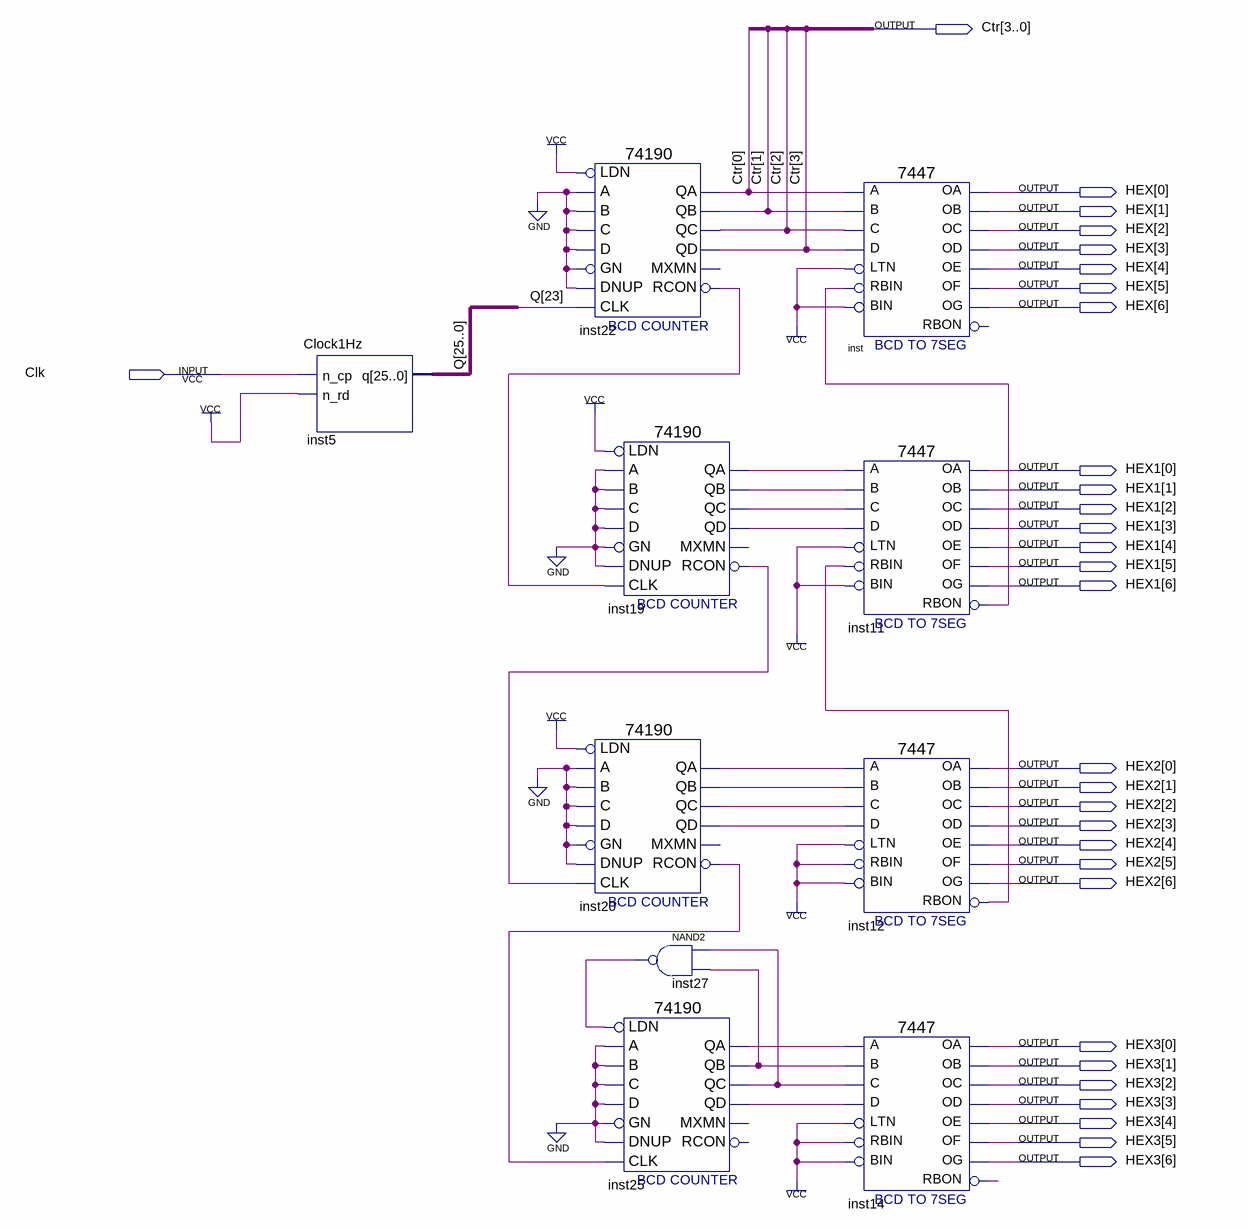
[diagram p0: schematic sheet]
// Quartus schematic 4digitsSeg.bdf as structural Verilog: 10 symbols, 30 pins
module \4digitsSeg  (
  input  Clk,
  output [3:0] Ctr,
  output [6:0] HEX,
  output [6:0] HEX1,
  output [6:0] HEX2,
  output [6:0] HEX3
);

  wire inst11_rbon, inst12_rbon, inst14_rbon, inst19_qa, inst19_qb, inst19_qc, inst19_qd, inst19_rcon,
       inst20_qa, inst20_qb, inst20_qc, inst20_qd, inst20_rcon, inst22_rcon, inst25_qa, inst25_qb, inst25_qc,
       inst25_qd, inst27_out;
  wire [25:0] Q;

  Clock1Hz inst5 (.n_cp(Clk), .n_rd(1'b1), .q(Q));
  \74190  inst22 (
    .LDN(1'b1), .A(1'b0), .C(1'b0), .B(1'b0), .D(1'b0), .GN(1'b0), .CLK(Q[23]), .DNUP(1'b0), .QA(Ctr[0]),
    .QB(Ctr[1]), .QD(Ctr[3]), .QC(Ctr[2]), .RCON(inst22_rcon));  // open: MXMN
  \74190  inst20 (
    .LDN(1'b1), .A(1'b0), .C(1'b0), .B(1'b0), .D(1'b0), .GN(1'b0), .CLK(inst19_rcon), .DNUP(1'b0),
    .QA(inst20_qa), .QB(inst20_qb), .QD(inst20_qd), .QC(inst20_qc), .RCON(inst20_rcon));  // open: MXMN
  \74190  inst19 (
    .LDN(1'b1), .A(1'b0), .C(1'b0), .B(1'b0), .D(1'b0), .GN(1'b0), .CLK(inst22_rcon), .DNUP(1'b0),
    .QA(inst19_qa), .QB(inst19_qb), .QD(inst19_qd), .QC(inst19_qc), .RCON(inst19_rcon));  // open: MXMN
  nand inst27 (inst27_out, inst25_qc, inst25_qb);
  \74190  inst25 (
    .LDN(inst27_out), .A(1'b0), .C(1'b0), .B(1'b0), .D(1'b0), .GN(1'b0), .CLK(inst20_rcon), .DNUP(1'b0),
    .QA(inst25_qa), .QB(inst25_qb), .QD(inst25_qd), .QC(inst25_qc));  // open: MXMN, RCON
  \7447  inst (
    .LTN(1'b1), .B(Ctr[1]), .C(Ctr[2]), .D(Ctr[3]), .RBIN(inst11_rbon), .BIN(1'b1), .A(Ctr[0]), .OB(HEX[1]),
    .OC(HEX[2]), .OE(HEX[4]), .OD(HEX[3]), .OF(HEX[5]), .OG(HEX[6]), .OA(HEX[0]));  // open: RBON
  \7447  inst11 (
    .LTN(1'b1), .B(inst19_qb), .C(inst19_qc), .D(inst19_qd), .RBIN(inst12_rbon), .BIN(1'b1), .A(inst19_qa),
    .OB(HEX1[1]), .OC(HEX1[2]), .OE(HEX1[4]), .OD(HEX1[3]), .OF(HEX1[5]), .OG(HEX1[6]), .OA(HEX1[0]),
    .RBON(inst11_rbon));
  \7447  inst12 (
    .LTN(1'b1), .B(inst20_qb), .C(inst20_qc), .D(inst20_qd), .RBIN(1'b1), .BIN(1'b1), .A(inst20_qa),
    .OB(HEX2[1]), .OC(HEX2[2]), .OE(HEX2[4]), .OD(HEX2[3]), .OF(HEX2[5]), .OG(HEX2[6]), .OA(HEX2[0]),
    .RBON(inst12_rbon));
  \7447  inst14 (
    .LTN(1'b1), .B(inst25_qb), .C(inst25_qc), .D(inst25_qd), .RBIN(1'b1), .BIN(1'b1), .A(inst25_qa),
    .OB(HEX3[1]), .OC(HEX3[2]), .OE(HEX3[4]), .OD(HEX3[3]), .OF(HEX3[5]), .OG(HEX3[6]), .OA(HEX3[0]),
    .RBON(inst14_rbon));
endmodule
